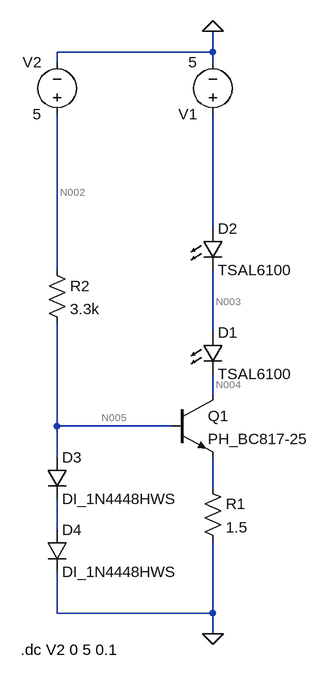
[diagram p0: schematic Draft1.asc]
Draft1.asc, the LTspice schematic file:
Version 4
SHEET 1 880 680
WIRE 64 -448 64 -480
WIRE 64 -448 -176 -448
WIRE -176 -432 -176 -448
WIRE 64 -432 64 -448
WIRE 64 -176 64 -352
WIRE -176 -112 -176 -352
WIRE 64 -16 64 -112
WIRE 64 80 64 48
WIRE -176 128 -176 -32
WIRE 0 128 -176 128
WIRE -176 176 -176 128
WIRE 64 224 64 176
WIRE -176 288 -176 240
WIRE -176 416 -176 352
WIRE 64 416 64 304
WIRE 64 416 -176 416
WIRE 64 448 64 416
FLAG 64 448 0
FLAG 64 -480 0
SYMBOL LED 48 -16 R0
SYMATTR InstName D1
SYMATTR Value TSAL6100
SYMATTR Description Diode
SYMATTR Type diode
SYMBOL LED 48 -176 R0
SYMATTR InstName D2
SYMATTR Value TSAL6100
SYMATTR Description Diode
SYMATTR Type diode
SYMBOL res 48 208 R0
SYMATTR InstName R1
SYMATTR Value 1.5
SYMATTR SpiceLine tol=10
SYMBOL npn2 0 80 R0
SYMATTR InstName Q1
SYMATTR Value PH_BC817-25
SYMBOL res -192 -128 R0
SYMATTR InstName R2
SYMATTR Value 3.3k
SYMATTR SpiceLine tol=10
SYMBOL diode -192 176 R0
SYMATTR InstName D3
SYMATTR Value DI_1N4448HWS
SYMBOL diode -192 288 R0
SYMATTR InstName D4
SYMATTR Value DI_1N4448HWS
SYMBOL voltage 64 -336 R180
WINDOW 123 0 0 Left 2
WINDOW 39 0 0 Left 2
SYMATTR InstName V1
SYMATTR Value 5
SYMBOL voltage -176 -336 R180
WINDOW 0 24 96 Left 2
WINDOW 3 24 16 Left 2
WINDOW 123 0 0 Left 2
WINDOW 39 0 0 Left 2
SYMATTR InstName V2
SYMATTR Value 5
TEXT -232 472 Left 2 !.dc V2 0 5 0.1

The netlist it stands for:
* Draft1.asc
D1 N003 N004 TSAL6100
D2 N001 N003 TSAL6100
R1 N006 0 1.5 tol=10
Q1 N004 N005 N006 0 PH_BC817-25
R2 N002 N005 3.3k tol=10
D3 N005 N007 DI_1N4448HWS
D4 N007 0 DI_1N4448HWS
V1 N001 0 5
V2 N002 0 5
.model D D
.lib standard.dio
.model NPN NPN
.model PNP PNP
.lib standard.bjt
.dc V2 0 5 0.1
.backanno
.end

* Results of the author's LTspice run, read from the files saved beside the schematic
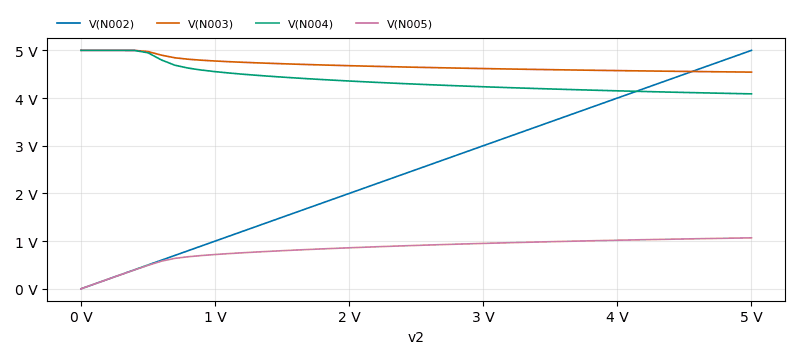
[diagram p1: DC transfer characteristic of Draft1.asc, plotted from the saved traces]
* DC transfer characteristic, 1 run:
*   V(N002): 0 V at v2=0 V, 5 V at v2=5 V, min 0 V, max 5 V
*   V(N003): 5 V at v2=0 V, 4.544 V at v2=5 V, min 4.544 V, max 5 V
*   V(N004): 5 V at v2=0 V, 4.088 V at v2=5 V, min 4.088 V, max 5 V
*   V(N005): 16.51 nV at v2=0 V, 1.068 V at v2=5 V, min 16.51 nV, max 1.068 V